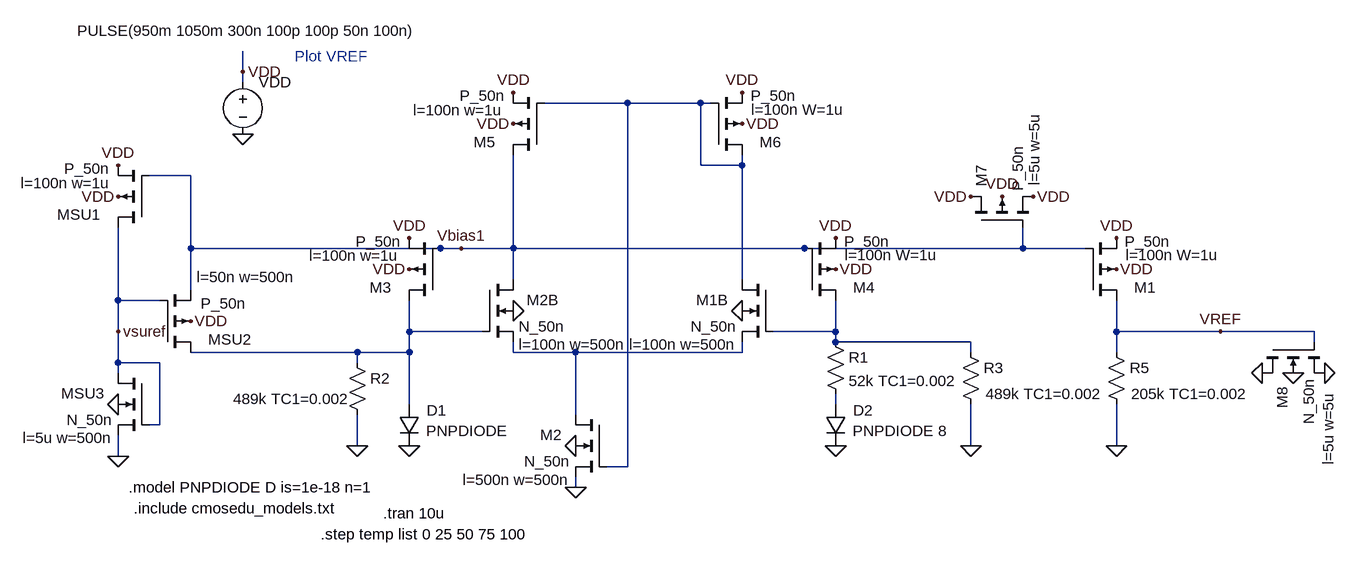
[diagram p0: schematic Fig23_31_VDD_noise.asc]
Fig23_31_VDD_noise.asc, the LTspice schematic file:
Version 4
SHEET 1 3412 680
WIRE 1616 -736 1616 -768
WIRE 1616 -720 1616 -736
WIRE 2208 -688 2080 -688
WIRE 2320 -688 2208 -688
WIRE 2336 -688 2320 -688
WIRE 2320 -592 2320 -688
WIRE 2384 -592 2384 -608
WIRE 2384 -592 2320 -592
WIRE 1536 -576 1472 -576
WIRE 1536 -464 1536 -576
WIRE 1920 -464 1536 -464
WIRE 1952 -464 1920 -464
WIRE 2032 -464 2032 -608
WIRE 2032 -464 1952 -464
WIRE 2480 -464 2032 -464
WIRE 2816 -464 2816 -496
WIRE 2816 -464 2480 -464
WIRE 2912 -464 2816 -464
WIRE 2032 -416 2032 -464
WIRE 2384 -416 2384 -592
WIRE 1536 -400 1536 -464
WIRE 1424 -384 1424 -496
WIRE 1488 -384 1424 -384
WIRE 1424 -336 1424 -384
WIRE 1872 -336 1872 -384
WIRE 1984 -336 1872 -336
WIRE 2528 -336 2528 -384
WIRE 2528 -336 2432 -336
WIRE 2960 -336 2960 -384
WIRE 3120 -336 2960 -336
WIRE 3264 -336 3120 -336
WIRE 2528 -320 2528 -336
WIRE 2736 -320 2528 -320
WIRE 3264 -320 3264 -336
WIRE 1792 -304 1536 -304
WIRE 1872 -304 1872 -336
WIRE 1872 -304 1792 -304
WIRE 2032 -304 2032 -320
WIRE 2128 -304 2032 -304
WIRE 2384 -304 2384 -320
WIRE 2384 -304 2128 -304
WIRE 2736 -304 2736 -320
WIRE 2960 -304 2960 -336
WIRE 1424 -288 1424 -336
WIRE 1488 -288 1424 -288
WIRE 1792 -288 1792 -304
WIRE 1424 -272 1424 -288
WIRE 1872 -224 1872 -304
WIRE 2528 -224 2528 -240
WIRE 2128 -208 2128 -304
WIRE 1488 -192 1488 -288
WIRE 1488 -192 1472 -192
WIRE 1792 -160 1792 -208
WIRE 2736 -160 2736 -224
WIRE 2960 -160 2960 -224
WIRE 1424 -144 1424 -176
WIRE 2208 -128 2208 -688
WIRE 2208 -128 2176 -128
WIRE 2128 -96 2128 -112
FLAG 1616 -640 0
FLAG 1616 -736 VDD
FLAG 1424 -224 0
FLAG 1424 -144 0
FLAG 1424 -544 VDD
FLAG 1424 -592 VDD
FLAG 1872 -480 VDD
FLAG 1872 -432 VDD
FLAG 2528 -432 VDD
FLAG 2528 -480 VDD
FLAG 2032 -368 0
FLAG 2384 -368 0
FLAG 1872 -160 0
FLAG 1536 -352 VDD
FLAG 1424 -336 vsuref
FLAG 1952 -464 Vbias1
FLAG 2528 -160 0
FLAG 1792 -160 0
FLAG 2736 -160 0
FLAG 2960 -432 VDD
FLAG 2960 -480 VDD
FLAG 2960 -160 0
FLAG 3120 -336 VREF
FLAG 2128 -160 0
FLAG 2032 -656 VDD
FLAG 2032 -704 VDD
FLAG 2384 -656 VDD
FLAG 2384 -704 VDD
FLAG 2128 -96 0
FLAG 2784 -544 VDD
FLAG 2736 -544 VDD
FLAG 2832 -544 VDD
FLAG 3232 -272 0
FLAG 3184 -272 0
FLAG 3280 -272 0
SYMBOL voltage 1616 -736 R0
WINDOW 123 0 0 Left 2
WINDOW 39 0 0 Left 2
WINDOW 3 -255 -63 Left 2
SYMATTR Value PULSE(950m 1050m 300n 100p 100p 50n 100n)
SYMATTR InstName VDD
SYMBOL nmos4 1472 -272 M0
WINDOW 123 56 100 Left 2
WINDOW 0 69 31 Left 2
SYMATTR Value2 l=5u w=500n
SYMATTR InstName MSU3
SYMATTR Value N_50n
SYMBOL pmos4 1472 -496 R180
WINDOW 0 75 20 Left 2
WINDOW 3 61 91 Left 2
WINDOW 123 59 69 Left 2
SYMATTR InstName MSU1
SYMATTR Value P_50n
SYMATTR Value2 l=100n w=1u
SYMBOL pmos4 1920 -384 R180
WINDOW 0 75 20 Left 2
WINDOW 3 61 91 Left 2
WINDOW 123 63 69 Left 2
SYMATTR InstName M3
SYMATTR Value P_50n
SYMATTR Value2 l=100n w=1u
SYMBOL pmos4 2480 -384 M180
WINDOW 0 75 20 Left 2
WINDOW 3 61 91 Left 2
WINDOW 123 62 70 Left 2
SYMATTR InstName M4
SYMATTR Value P_50n
SYMATTR Value2 l=100n W=1u
SYMBOL nmos4 1984 -416 R0
WINDOW 123 56 100 Left 2
WINDOW 0 69 31 Left 2
SYMATTR Value2 l=100n w=500n
SYMATTR InstName M2B
SYMATTR Value N_50n
SYMBOL nmos4 2432 -416 M0
WINDOW 123 56 100 Left 2
WINDOW 0 69 31 Left 2
SYMATTR Value2 l=100n w=500n
SYMATTR InstName M1B
SYMATTR Value N_50n
SYMBOL res 2512 -336 R0
SYMATTR InstName R1
SYMATTR Value 52k TC1=0.002
SYMBOL diode 1856 -224 R0
WINDOW 0 43 9 Left 2
WINDOW 3 42 41 Left 2
SYMATTR InstName D1
SYMATTR Value PNPDIODE
SYMBOL pmos4 1488 -304 M180
WINDOW 0 75 20 Left 2
WINDOW 3 63 75 Left 2
WINDOW 123 57 116 Left 2
SYMATTR InstName MSU2
SYMATTR Value P_50n
SYMATTR Value2 l=50n w=500n
SYMBOL diode 2512 -224 R0
WINDOW 0 43 9 Left 2
WINDOW 3 42 41 Left 2
SYMATTR InstName D2
SYMATTR Value PNPDIODE 8
SYMBOL res 1776 -304 R0
WINDOW 3 -175 72 Left 2
SYMATTR Value 489k TC1=0.002
SYMATTR InstName R2
SYMBOL res 2720 -320 R0
WINDOW 3 39 80 Left 2
SYMATTR Value 489k TC1=0.002
SYMATTR InstName R3
SYMBOL pmos4 2912 -384 M180
WINDOW 0 75 20 Left 2
WINDOW 3 61 91 Left 2
WINDOW 123 62 70 Left 2
SYMATTR InstName M1
SYMATTR Value P_50n
SYMATTR Value2 l=100n W=1u
SYMBOL res 2944 -320 R0
WINDOW 3 39 80 Left 2
SYMATTR Value 205k TC1=0.002
SYMATTR InstName R5
SYMBOL nmos4 2176 -208 M0
WINDOW 123 56 100 Left 2
WINDOW 0 69 31 Left 2
SYMATTR Value2 l=500n w=500n
SYMATTR InstName M2
SYMATTR Value N_50n
SYMBOL pmos4 2080 -608 R180
WINDOW 0 75 20 Left 2
WINDOW 3 61 91 Left 2
WINDOW 123 63 69 Left 2
SYMATTR InstName M5
SYMATTR Value P_50n
SYMATTR Value2 l=100n w=1u
SYMBOL pmos4 2336 -608 M180
WINDOW 0 75 20 Left 2
WINDOW 3 61 91 Left 2
WINDOW 123 62 70 Left 2
SYMATTR InstName M6
SYMATTR Value P_50n
SYMATTR Value2 l=100n W=1u
SYMBOL pmos4 2736 -496 R270
WINDOW 0 63 16 Left 2
WINDOW 123 65 98 Left 2
SYMATTR InstName M7
SYMATTR Value2 l=5u w=5u
SYMATTR Value P_50n
SYMBOL nmos4 3184 -320 M90
WINDOW 123 78 102 Left 2
WINDOW 0 69 31 Left 2
SYMATTR Value2 l=5u w=5u
SYMATTR InstName M8
SYMATTR Value N_50n
TEXT 1448 -64 Left 2 !.include cmosedu_models.txt
TEXT 1696 -760 Left 2 ;Plot VREF
TEXT 1832 -56 Left 2 !.tran 10u
TEXT 1736 -24 Left 2 !.step temp list 0 25 50 75 100
TEXT 1440 -96 Left 2 !.model PNPDIODE D is=1e-18 n=1

The netlist it stands for:
* Fig23_31_VDD_noise.asc
VDD VDD 0 PULSE(950m 1050m 300n 100p 100p 50n 100n)
MSU3 vsuref vsuref 0 0 N_50n l=5u w=500n
MSU1 vsuref Vbias1 VDD VDD P_50n l=100n w=1u
M3 N002 Vbias1 VDD VDD P_50n l=100n w=1u
M4 N003 Vbias1 VDD VDD P_50n l=100n W=1u
M2B Vbias1 N002 N004 0 N_50n l=100n w=500n
M1B N001 N003 N004 0 N_50n l=100n w=500n
R1 N003 N005 52k TC1=0.002
D1 N002 0 PNPDIODE
MSU2 N002 vsuref Vbias1 VDD P_50n l=50n w=500n
D2 N005 0 PNPDIODE 8
R2 N002 0 489k TC1=0.002
R3 N003 0 489k TC1=0.002
M1 VREF Vbias1 VDD VDD P_50n l=100n W=1u
R5 VREF 0 205k TC1=0.002
M2 N004 N001 0 0 N_50n l=500n w=500n
M5 Vbias1 N001 VDD VDD P_50n l=100n w=1u
M6 N001 N001 VDD VDD P_50n l=100n W=1u
M7 VDD Vbias1 VDD VDD P_50n l=5u w=5u
M8 0 VREF 0 0 N_50n l=5u w=5u
.model D D
.lib standard.dio
.model NMOS NMOS
.model PMOS PMOS
.lib standard.mos
.include cmosedu_models.txt
* Plot VREF
.tran 10u
.step temp list 0 25 50 75 100
.model PNPDIODE D is=1e-18 n=1
.backanno
.end